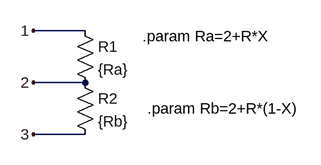
[diagram p0: schematic pot.asc]
pot.asc, the LTspice schematic file:
Version 4
SHEET 1 880 680
WIRE 160 48 80 48
WIRE 160 128 80 128
WIRE 160 208 80 208
FLAG 80 48 1
FLAG 80 128 2
FLAG 80 208 3
SYMBOL res 144 32 R0
SYMATTR InstName R1
SYMATTR Value {Ra}
SYMATTR SpiceLine tol=20 pwr=500m
SYMBOL res 144 112 R0
SYMATTR InstName R2
SYMATTR Value {Rb}
SYMATTR SpiceLine tol=20 pwr=500m
TEXT 248 56 Left 2 !.param Ra=2+R*X
TEXT 256 168 Left 2 !.param Rb=2+R*(1-X)

The netlist it stands for:
* pot.asc
R1 1 2 {Ra} tol=20 pwr=500m
R2 2 3 {Rb} tol=20 pwr=500m
.param Ra=2+R*X
.param Rb=2+R*(1-X)
.backanno
.end